# EasyEDA Pro project ProPrj_ESP32-S3.epro, schematic Schematic1_1

## Sheets
1 P1: Board Name: Board1_1; Create Date: 2026-04-16; Page Name: P1; Project Name: ESP32-S3 CNC controller; Schematic Name: Schematic1_1; Update Date: 2026-04-16; Company: EasyEDA.com; Page Size: A4; Version: V1.0
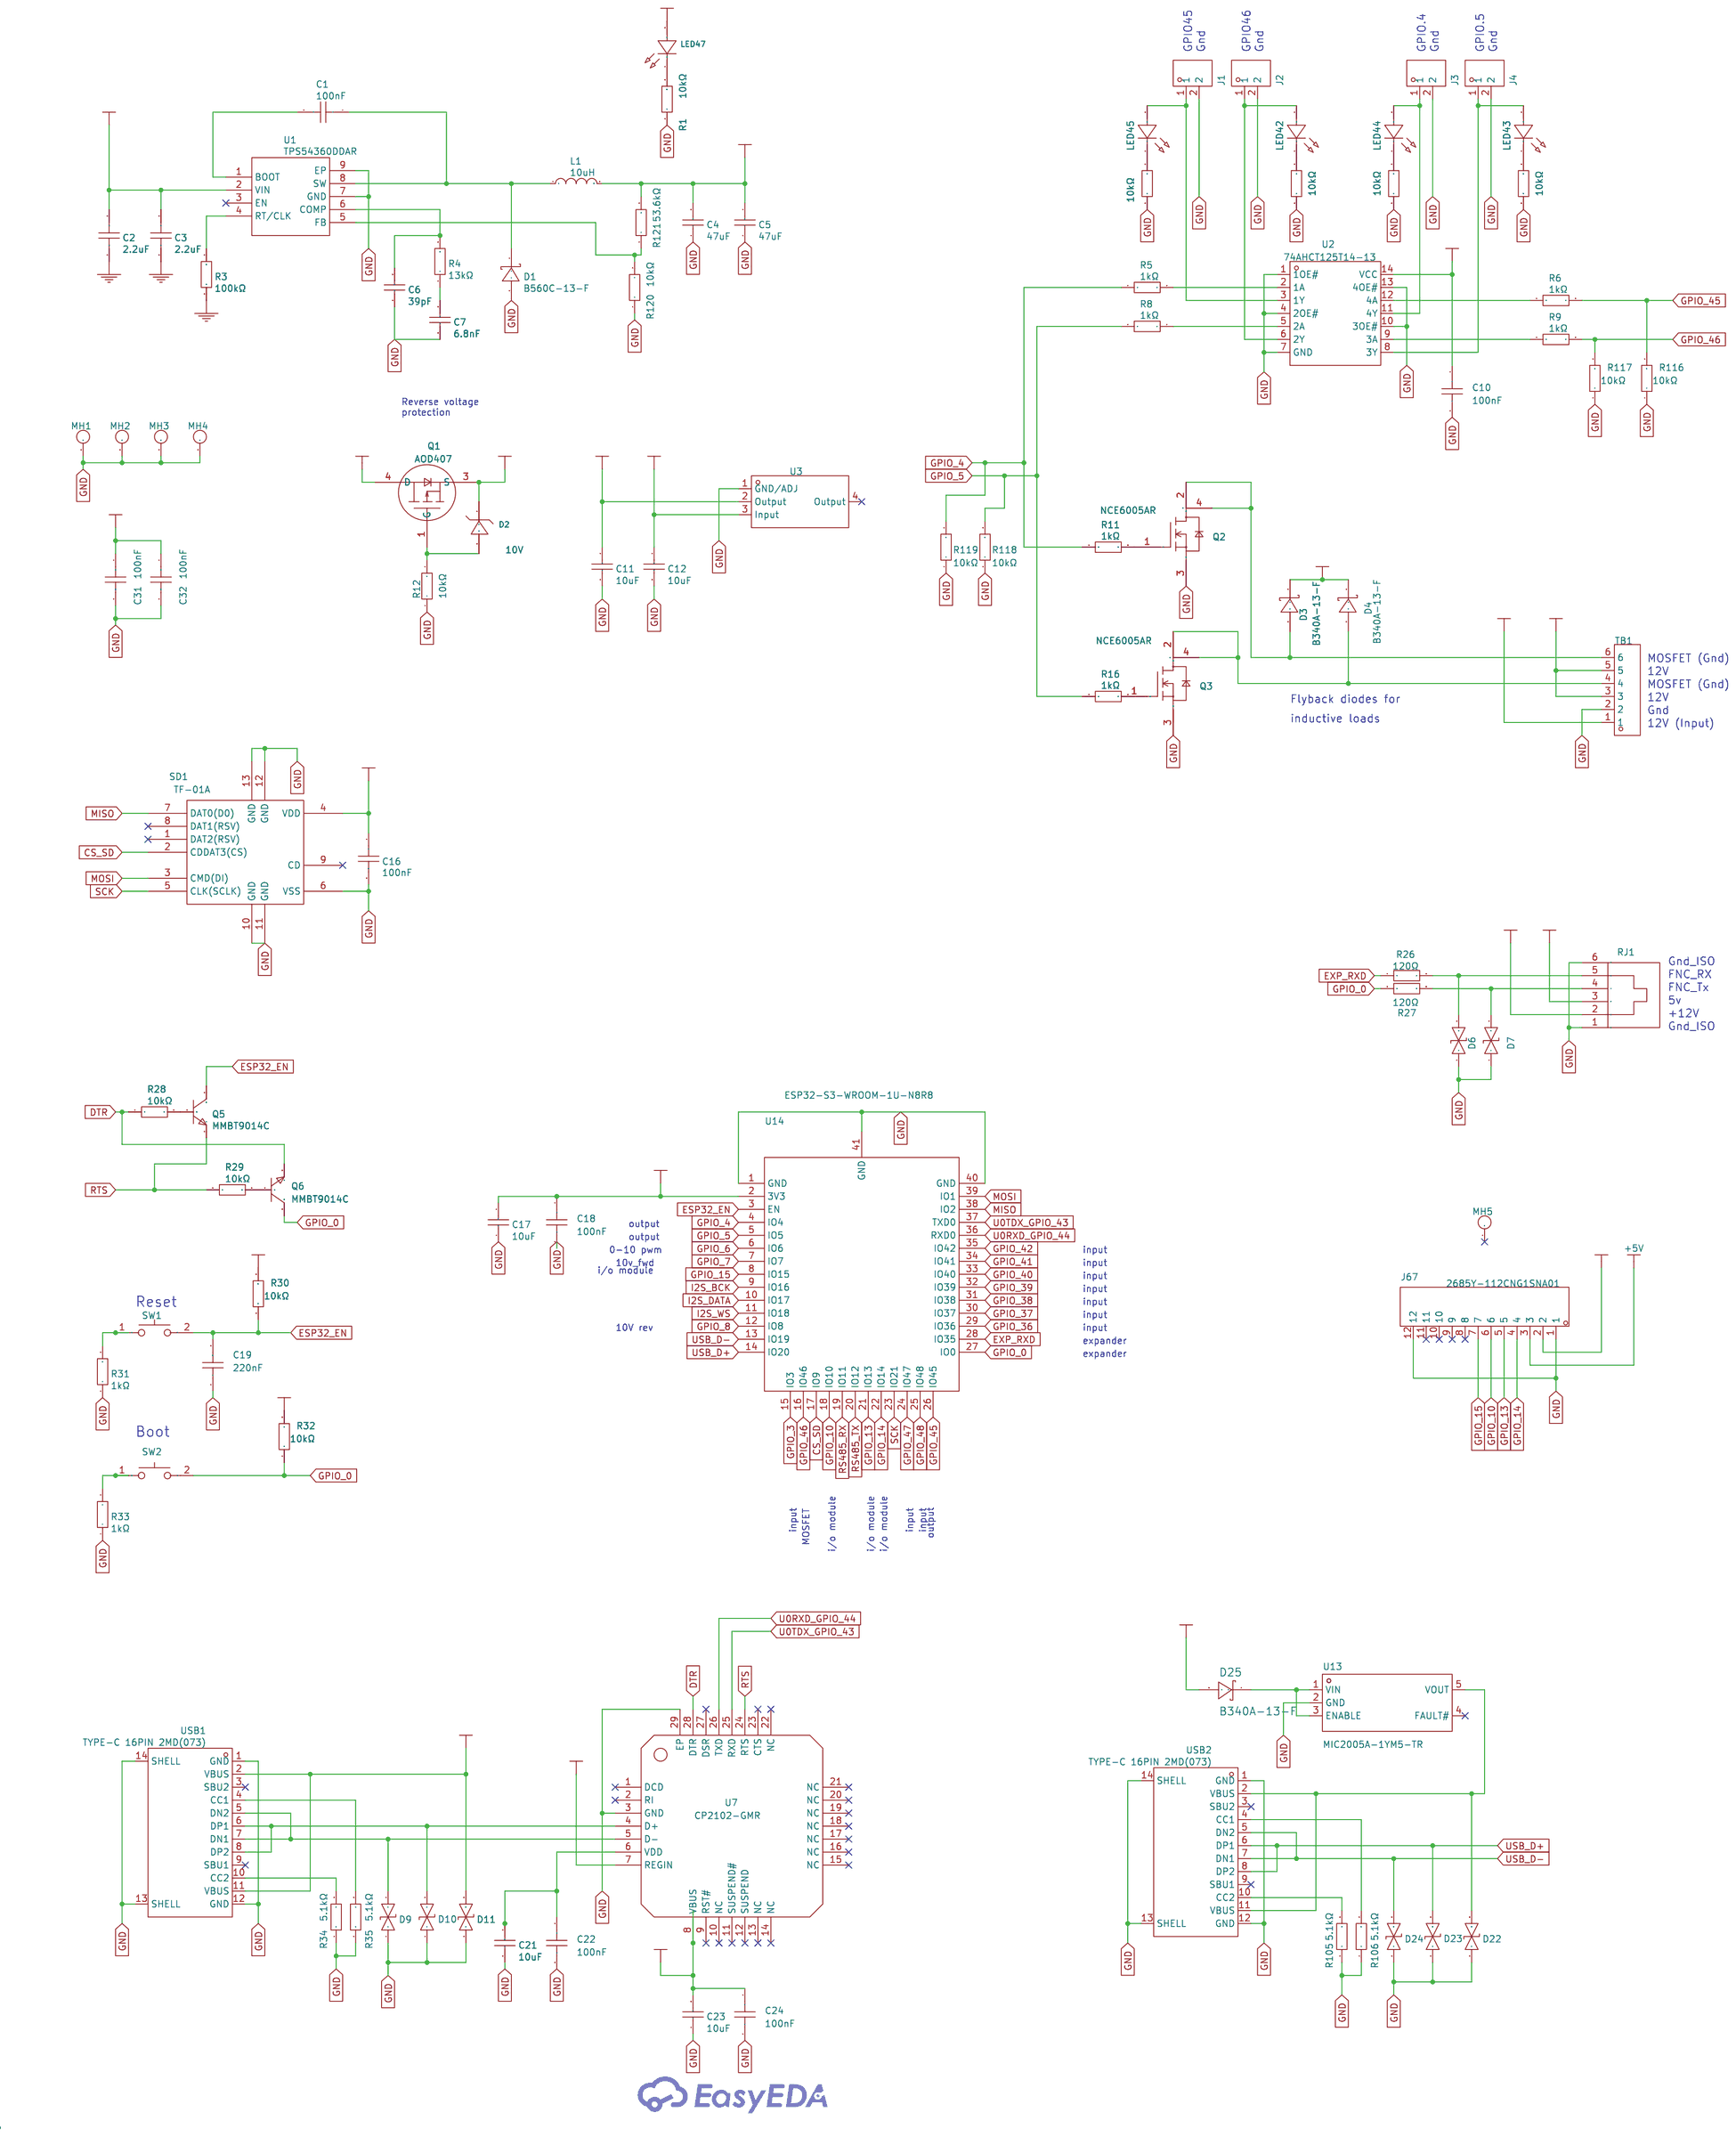
[diagram p0: P1]
2 P2: Page Name: P2
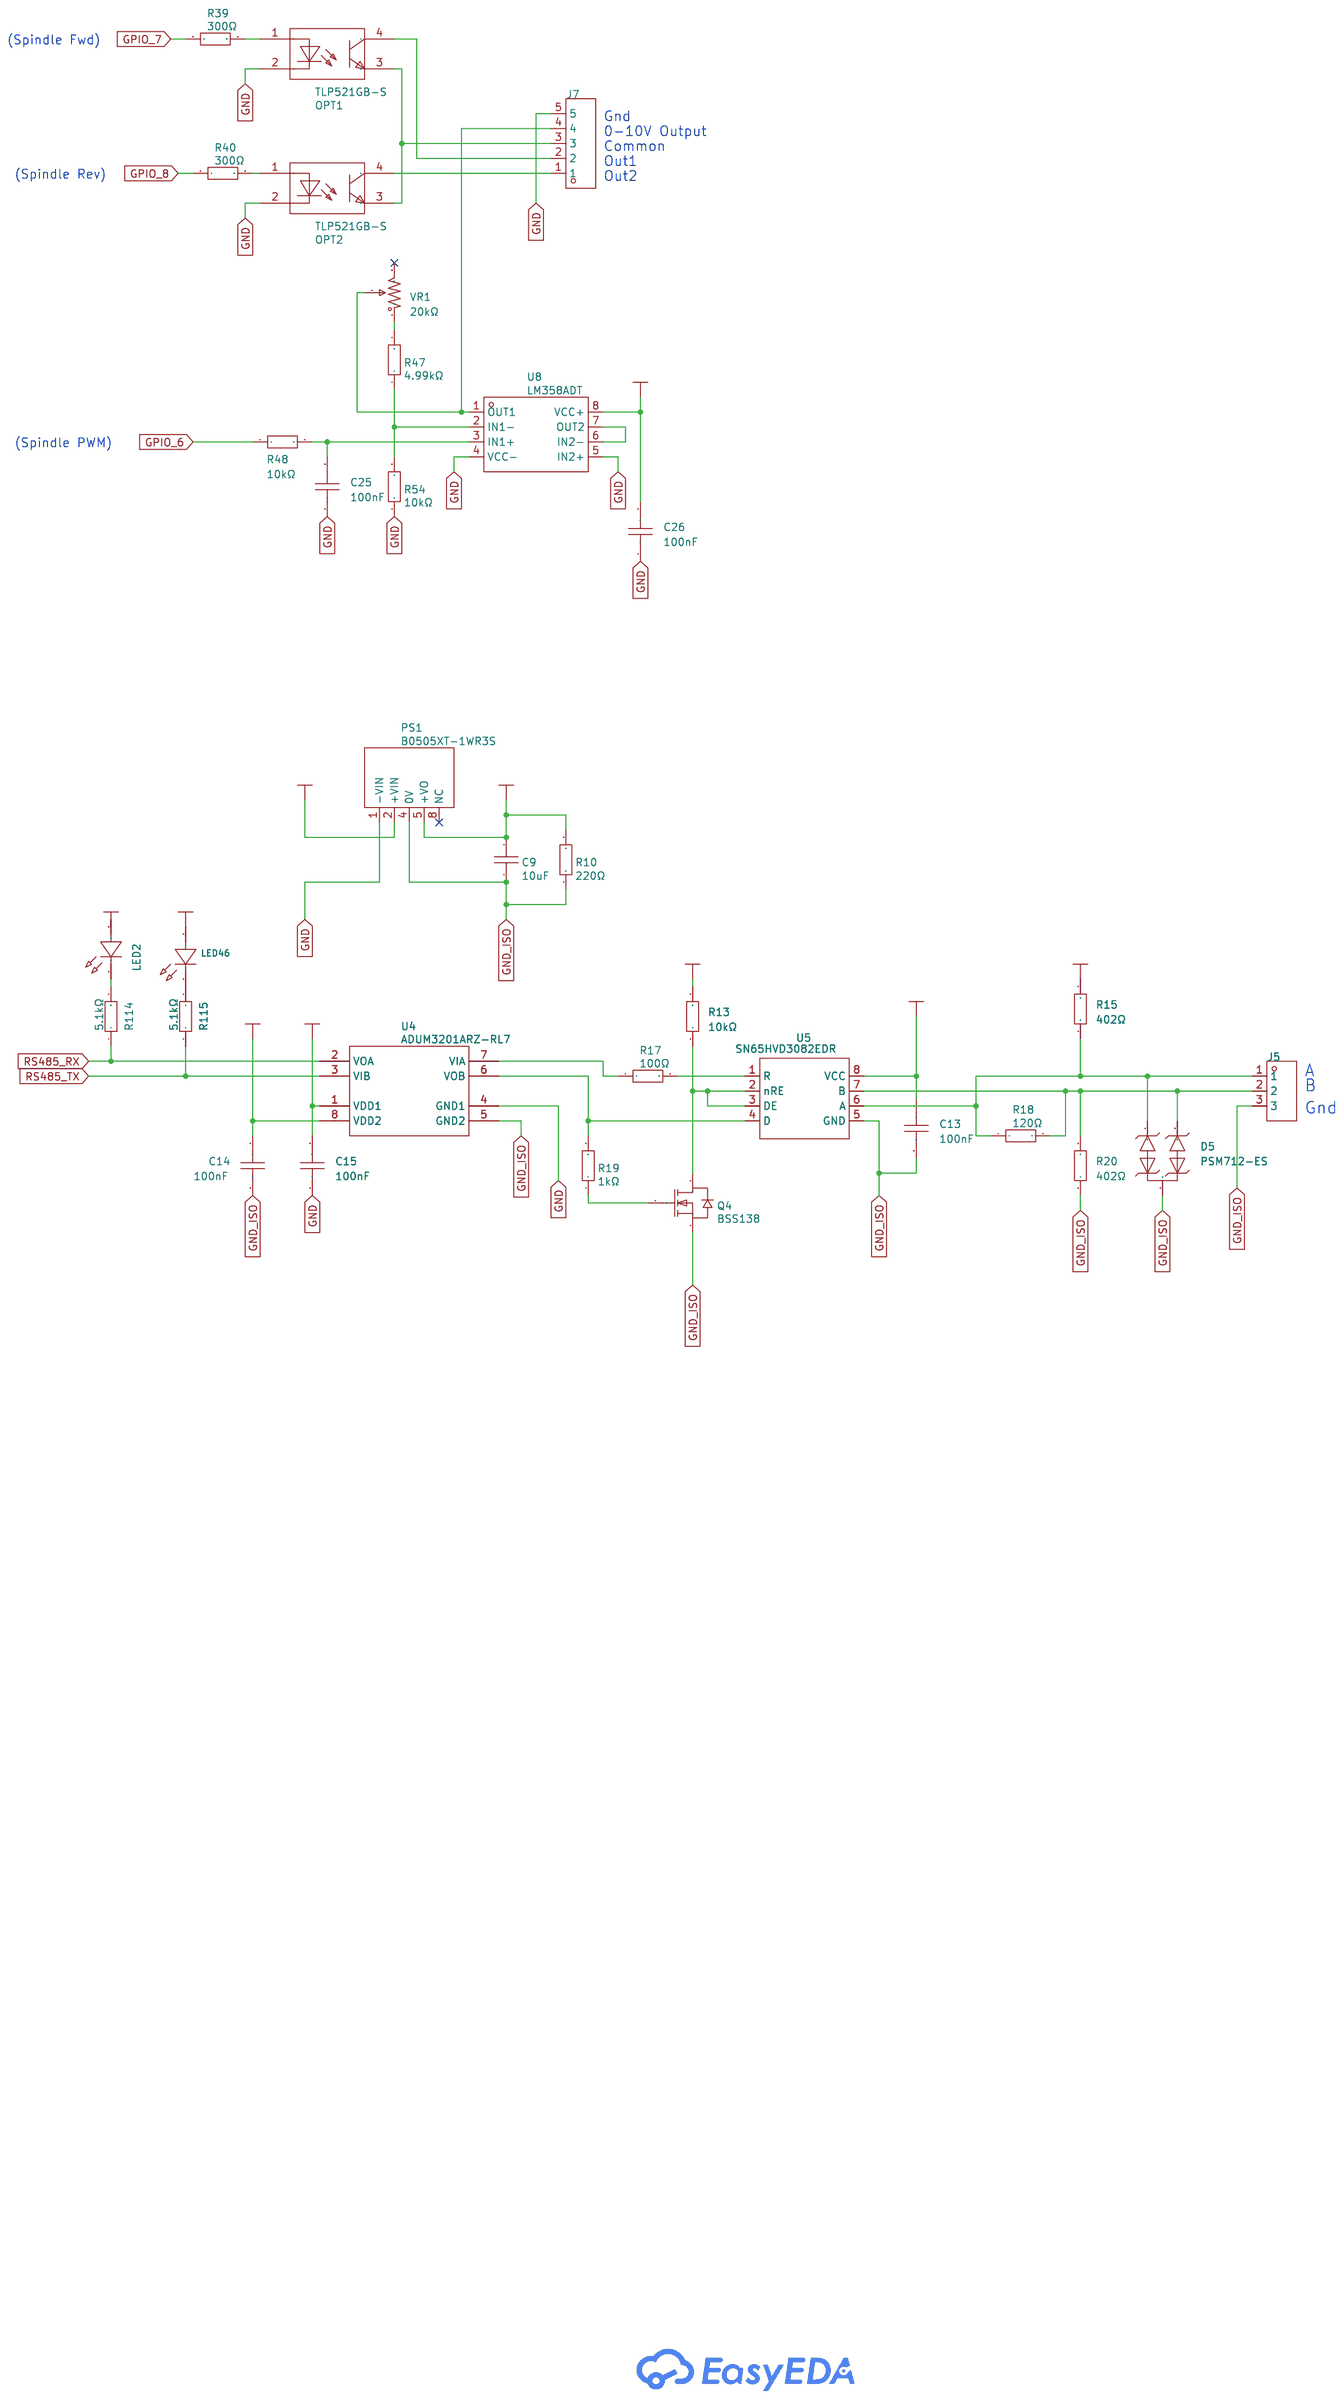
[diagram p1: P2]
3 P3: Page Name: P3; Drawn: B. Dring; Reviewed: B. Dring; Version: V0.9
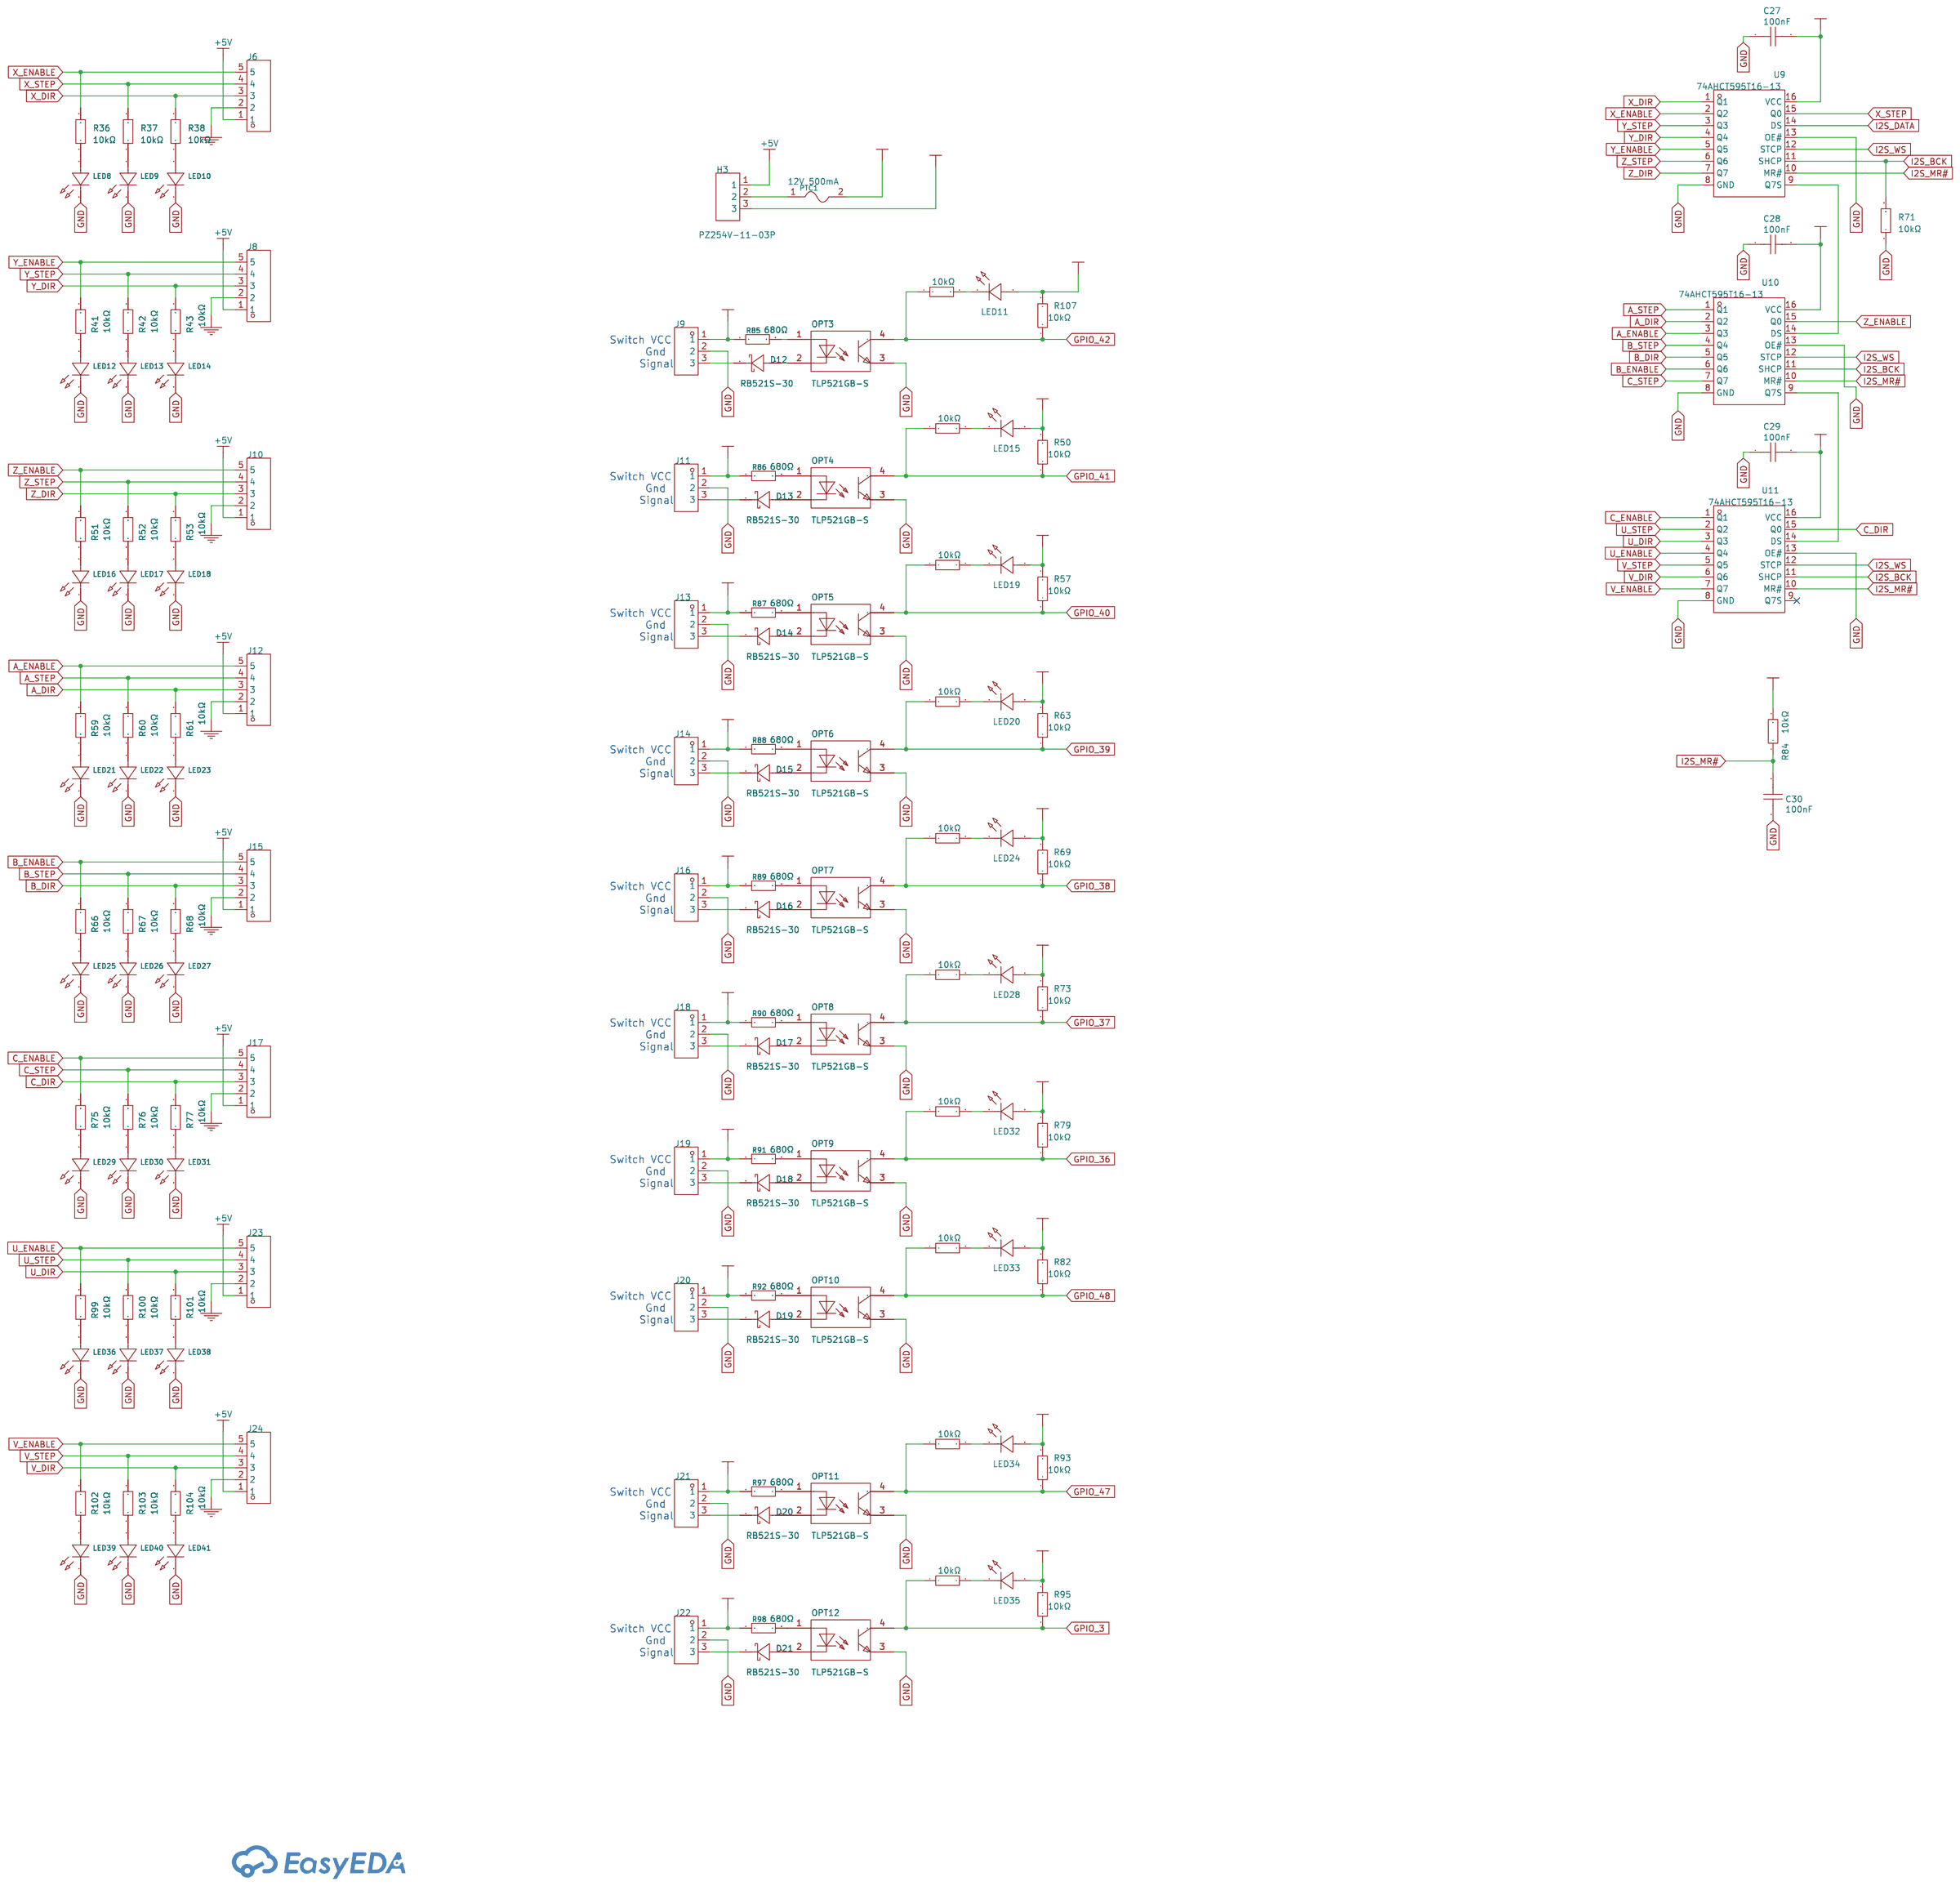
[diagram p2: P3]

## Parts
sheet P1
C1  100nF  [C0402]
C2  2.2uF  [C0805]
C3  2.2uF  [C0805]
C4  47uF  [C0805]
C5  47uF  [C0805]
C6  39pF  [C0402]
C7  6.8nF  [C0402]
C10  100nF  [C0402]
C11  10uF  [C0805]
C12  10uF  [C0805]
C16  100nF  [C0402]
C17  10uF  [C0805]
C18  100nF  [C0402]
C19  220nF  [C0402]
C21  10uF  [C0805]
C22  100nF  [C0402]
C23  10uF  [C0805]
C24  100nF  [C0402]
C31  100nF  [C0402]
C32  100nF  [C0402]
D1  B560C-13-F  [SMC_L7.1-W6.2-LS8.1-RD]
D2  10V  [SOD-123_L2.8-W1.8-LS3.7-RD]
D3  B340A-13-F  [SMA_L4.4-W2.6-LS5.0-RD]
D4  B340A-13-F  [SMA_L4.4-W2.6-LS5.0-RD]
D6  SD03C_C502532  [SOD-323_L1.8-W1.3-LS2.5-BI]
D7  SD03C_C502532  [SOD-323_L1.8-W1.3-LS2.5-BI]
D9  LESD5D5.0CT1G  [SOD-523_L1.2-W0.8-LS1.6-BI]
D10  LESD5D5.0CT1G  [SOD-523_L1.2-W0.8-LS1.6-BI]
D11  LESD5D5.0CT1G  [SOD-523_L1.2-W0.8-LS1.6-BI]
D22  LESD5D5.0CT1G  [SOD-523_L1.2-W0.8-LS1.6-BI]
D23  LESD5D5.0CT1G  [SOD-523_L1.2-W0.8-LS1.6-BI]
D24  LESD5D5.0CT1G  [SOD-523_L1.2-W0.8-LS1.6-BI]
D25  B340A-13-F  [SMA_L4.4-W2.6-LS5.0-RD]
J1  ZX-XH2.54-2PZZ-R  [CONN-TH_XH2.54-2P]
J2  ZX-XH2.54-2PZZ-R  [CONN-TH_XH2.54-2P]
J3  ZX-XH2.54-2PZZ-R  [CONN-TH_XH2.54-2P]
J4  ZX-XH2.54-2PZZ-R  [CONN-TH_XH2.54-2P]
J67  2685Y-112CNG1SNA01  [HDR-TH_12P-P2.54-V-F]
L1  10uH  [IND-SMD_L7.1-W6.6]
LED42  XL-1608SURC-06  [LED0603-RD_RED]
LED43  XL-1608SURC-06  [LED0603-RD_RED]
LED44  XL-1608SURC-06  [LED0603-RD_RED]
LED45  XL-1608SURC-06  [LED0603-RD_RED]
LED47  XL-1608UGC-04  [LED0603-RD_GREEN]
MH1  Mounting Hole 3.5  [MOUNTING HOLE 3.5]
MH2  Mounting Hole 3.5  [MOUNTING HOLE 3.5]
MH3  Mounting Hole 3.5  [MOUNTING HOLE 3.5]
MH4  Mounting Hole 3.5  [MOUNTING HOLE 3.5]
MH5  Mounting Hole 3.5  [MOUNTING HOLE 3.5]
Q1  AOD407  [TO-252-2_L6.5-W6.1-P4.58-LS10.0-TL]
Q2  NCE6005AR  [SOT-223_L6.5-W3.5-P2.30-LS7.0-BR]
Q3  NCE6005AR  [SOT-223_L6.5-W3.5-P2.30-LS7.0-BR]
Q5  MMBT9014C  [SOT-23-3_L2.9-W1.3-P1.90-LS2.4-BR]
Q6  MMBT9014C  [SOT-23-3_L2.9-W1.3-P1.90-LS2.4-BR]
R1  10kΩ  [R0402]
R3  100kΩ  [R0402]
R4  13kΩ  [R0402]
R5  1kΩ  [R0402]
R6  1kΩ  [R0402]
R8  1kΩ  [R0402]
R9  1kΩ  [R0402]
R11  1kΩ  [R0402]
R12  10kΩ  [R0402]
R16  1kΩ  [R0402]
R26  120Ω  [R0402]
R27  120Ω  [R0402]
R28  10kΩ  [R0402]
R29  10kΩ  [R0402]
R30  10kΩ  [R0402]
R31  1kΩ  [R0402]
R32  10kΩ  [R0402]
R33  1kΩ  [R0402]
R34  5.1kΩ  [R0402]
R35  5.1kΩ  [R0402]
R105  5.1kΩ  [R0402]
R106  5.1kΩ  [R0402]
R110  10kΩ  [R0402]
R111  10kΩ  [R0402]
R112  10kΩ  [R0402]
R113  10kΩ  [R0402]
R116  10kΩ  [R0402]
R117  10kΩ  [R0402]
R118  10kΩ  [R0402]
R119  10kΩ  [R0402]
R120  10kΩ  [R0402]
R121  53.6kΩ  [R0402]
RJ1  RJ1  [RJ11-TH_PCB-6P6C-90]
SD1  TF-01A  [TF-SMD_TF-01A]
SW1  SKRKAEE020  [KEY-SMD_L3.9-W3.0-LS5.0]
SW2  SKRKAEE020  [KEY-SMD_L3.9-W3.0-LS5.0]
TB1  DB125-3.5-6P-GN-S  [CONN-TH_6P-P3.50_DB125-3.5-6P-GN-S]
U1  TPS54360DDAR  [SOIC-8_L5.0-W4.0-P1.27-LS6.0-BL-EP2.0]
U2  74AHCT125T14-13  [TSSOP-14_L5.0-W4.4-P0.65-LS6.4-BL]
U3  AMS1117-3.3_C369933  [SOT-223-4_L6.5-W3.5-P2.30-LS7.0-BR]
U7  CP2102-GMR  [WQFN-28_L5.0-W5.0-P0.50-BL-EP3.2]
U13  MIC2005A-1YM5-TR  [SOT-23-5_L3.0-W1.7-P0.95-LS2.8-BL]
U14  ESP32-S3-WROOM-1U-N8R8  [WIRELM-SMD_ESP32-S3-WROOM-1U]
USB1  TYPE-C 16PIN 2MD(073)  [USB-C-SMD_TYPE-C-6PIN-2MD-073]
USB2  TYPE-C 16PIN 2MD(073)  [USB-C-SMD_TYPE-C-6PIN-2MD-073]
sheet P2
C9  10uF  [C0805]
C13  100nF  [C0402]
C14  100nF  [C0402]
C15  100nF  [C0402]
C25  100nF  [C0402]
C26  100nF  [C0402]
D5  PSM712-ES  [SOT-23-3_L2.9-W1.3-P1.90-LS2.4-BR]
J5  ZX-XH2.54-3PZZ  [CONN-TH_3P-P2.54_2501S-3P]
J7  B5B-XH-A-M(LF)(SN)  [CONN-TH_5P-P2.50_JST_B5B-XH-A-M]
LED2  XL-1608SURC-06  [LED0603-RD_RED]
LED46  XL-1608UGC-04  [LED0603-RD_GREEN]
OPT1  TLP521GB-S  [OPTO-SMD-4_L6.5-W4.6-P2.54-LS10.0-TL]
OPT2  TLP521GB-S  [OPTO-SMD-4_L6.5-W4.6-P2.54-LS10.0-TL]
PS1  B0505XT-1WR3S  [PWRM-SMD_B0505XT-1WR3S]
Q4  BSS138  [SOT-23-3_L2.9-W1.3-P1.90-LS2.4-BR]
R10  220Ω  [R0402]
R13  10kΩ  [R0402]
R15  402Ω  [R0402]
R17  100Ω  [R0402]
R18  120Ω  [R0402]
R19  1kΩ  [R0402]
R20  402Ω  [R0402]
R39  300Ω  [R0402]
R40  300Ω  [R0402]
R47  4.99kΩ  [R0402]
R48  10kΩ  [R0402]
R54  10kΩ  [R0402]
R114  5.1kΩ  [R0402]
R115  5.1kΩ  [R0402]
U4  ADUM3201ARZ-RL7  [SOIC-8_L5.0-W4.0-P1.27-LS6.0-BL]
U5  SN65HVD3082EDR  [SOIC-8_L5.0-W4.0-P1.27-LS6.0-BL]
U8  LM358ADT  [SOIC-8_L4.9-W3.9-P1.27-LS6.0-BL]
VR1  20kΩ  [RES-ADJ-SMD_TC33X-2-104E]
sheet P3
C27  100nF  [C0402]
C28  100nF  [C0402]
C29  100nF  [C0402]
C30  100nF  [C0402]
D12  RB521S-30  [SOD-523_L1.2-W0.8-LS1.6-RD]
D13  RB521S-30  [SOD-523_L1.2-W0.8-LS1.6-RD]
D14  RB521S-30  [SOD-523_L1.2-W0.8-LS1.6-RD]
D15  RB521S-30  [SOD-523_L1.2-W0.8-LS1.6-RD]
D16  RB521S-30  [SOD-523_L1.2-W0.8-LS1.6-RD]
D17  RB521S-30  [SOD-523_L1.2-W0.8-LS1.6-RD]
D18  RB521S-30  [SOD-523_L1.2-W0.8-LS1.6-RD]
D19  RB521S-30  [SOD-523_L1.2-W0.8-LS1.6-RD]
D20  RB521S-30  [SOD-523_L1.2-W0.8-LS1.6-RD]
D21  RB521S-30  [SOD-523_L1.2-W0.8-LS1.6-RD]
H3  PZ254V-11-03P  [HDR-TH_3P-P2.54-V-M]
J6  B5B-XH-A-M(LF)(SN)  [CONN-TH_5P-P2.50_JST_B5B-XH-A-M]
J8  B5B-XH-A-M(LF)(SN)  [CONN-TH_5P-P2.50_JST_B5B-XH-A-M]
J9  ZX-XH2.54-3PZZ  [CONN-TH_3P-P2.54_2501S-3P]
J10  B5B-XH-A-M(LF)(SN)  [CONN-TH_5P-P2.50_JST_B5B-XH-A-M]
J11  ZX-XH2.54-3PZZ  [CONN-TH_3P-P2.54_2501S-3P]
J12  B5B-XH-A-M(LF)(SN)  [CONN-TH_5P-P2.50_JST_B5B-XH-A-M]
J13  ZX-XH2.54-3PZZ  [CONN-TH_3P-P2.54_2501S-3P]
J14  ZX-XH2.54-3PZZ  [CONN-TH_3P-P2.54_2501S-3P]
J15  B5B-XH-A-M(LF)(SN)  [CONN-TH_5P-P2.50_JST_B5B-XH-A-M]
J16  ZX-XH2.54-3PZZ  [CONN-TH_3P-P2.54_2501S-3P]
J17  B5B-XH-A-M(LF)(SN)  [CONN-TH_5P-P2.50_JST_B5B-XH-A-M]
J18  ZX-XH2.54-3PZZ  [CONN-TH_3P-P2.54_2501S-3P]
J19  ZX-XH2.54-3PZZ  [CONN-TH_3P-P2.54_2501S-3P]
J20  ZX-XH2.54-3PZZ  [CONN-TH_3P-P2.54_2501S-3P]
J21  ZX-XH2.54-3PZZ  [CONN-TH_3P-P2.54_2501S-3P]
J22  ZX-XH2.54-3PZZ  [CONN-TH_3P-P2.54_2501S-3P]
J23  B5B-XH-A-M(LF)(SN)  [CONN-TH_5P-P2.50_JST_B5B-XH-A-M]
J24  B5B-XH-A-M(LF)(SN)  [CONN-TH_5P-P2.50_JST_B5B-XH-A-M]
LED8  XL-1608UGC-04  [LED0603-RD_GREEN]
LED9  XL-1608UGC-04  [LED0603-RD_GREEN]
LED10  XL-1608UGC-04  [LED0603-RD_GREEN]
LED11  XL-1608SURC-06  [LED0603-RD_RED]
LED12  XL-1608UGC-04  [LED0603-RD_GREEN]
LED13  XL-1608UGC-04  [LED0603-RD_GREEN]
LED14  XL-1608UGC-04  [LED0603-RD_GREEN]
LED15  XL-1608SURC-06  [LED0603-RD_RED]
LED16  XL-1608UGC-04  [LED0603-RD_GREEN]
LED17  XL-1608UGC-04  [LED0603-RD_GREEN]
LED18  XL-1608UGC-04  [LED0603-RD_GREEN]
LED19  XL-1608SURC-06  [LED0603-RD_RED]
LED20  XL-1608SURC-06  [LED0603-RD_RED]
LED21  XL-1608UGC-04  [LED0603-RD_GREEN]
LED22  XL-1608UGC-04  [LED0603-RD_GREEN]
LED23  XL-1608UGC-04  [LED0603-RD_GREEN]
LED24  XL-1608SURC-06  [LED0603-RD_RED]
LED25  XL-1608UGC-04  [LED0603-RD_GREEN]
LED26  XL-1608UGC-04  [LED0603-RD_GREEN]
LED27  XL-1608UGC-04  [LED0603-RD_GREEN]
LED28  XL-1608SURC-06  [LED0603-RD_RED]
LED29  XL-1608UGC-04  [LED0603-RD_GREEN]
LED30  XL-1608UGC-04  [LED0603-RD_GREEN]
LED31  XL-1608UGC-04  [LED0603-RD_GREEN]
LED32  XL-1608SURC-06  [LED0603-RD_RED]
LED33  XL-1608SURC-06  [LED0603-RD_RED]
LED34  XL-1608SURC-06  [LED0603-RD_RED]
LED35  XL-1608SURC-06  [LED0603-RD_RED]
LED36  XL-1608UGC-04  [LED0603-RD_GREEN]
LED37  XL-1608UGC-04  [LED0603-RD_GREEN]
LED38  XL-1608UGC-04  [LED0603-RD_GREEN]
LED39  XL-1608UGC-04  [LED0603-RD_GREEN]
LED40  XL-1608UGC-04  [LED0603-RD_GREEN]
LED41  XL-1608UGC-04  [LED0603-RD_GREEN]
OPT3  TLP521GB-S  [OPTO-SMD-4_L6.5-W4.6-P2.54-LS10.0-TL]
OPT4  TLP521GB-S  [OPTO-SMD-4_L6.5-W4.6-P2.54-LS10.0-TL]
OPT5  TLP521GB-S  [OPTO-SMD-4_L6.5-W4.6-P2.54-LS10.0-TL]
OPT6  TLP521GB-S  [OPTO-SMD-4_L6.5-W4.6-P2.54-LS10.0-TL]
OPT7  TLP521GB-S  [OPTO-SMD-4_L6.5-W4.6-P2.54-LS10.0-TL]
OPT8  TLP521GB-S  [OPTO-SMD-4_L6.5-W4.6-P2.54-LS10.0-TL]
OPT9  TLP521GB-S  [OPTO-SMD-4_L6.5-W4.6-P2.54-LS10.0-TL]
OPT10  TLP521GB-S  [OPTO-SMD-4_L6.5-W4.6-P2.54-LS10.0-TL]
OPT11  TLP521GB-S  [OPTO-SMD-4_L6.5-W4.6-P2.54-LS10.0-TL]
OPT12  TLP521GB-S  [OPTO-SMD-4_L6.5-W4.6-P2.54-LS10.0-TL]
PTC1  12V 500mA  [F0805]
R36  10kΩ  [R0402]
R37  10kΩ  [R0402]
R38  10kΩ  [R0402]
R41  10kΩ  [R0402]
R42  10kΩ  [R0402]
R43  10kΩ  [R0402]
R44  10kΩ  [R0402]
R49  10kΩ  [R0402]
R50  10kΩ  [R0402]
R51  10kΩ  [R0402]
R52  10kΩ  [R0402]
R53  10kΩ  [R0402]
R56  10kΩ  [R0402]
R57  10kΩ  [R0402]
R59  10kΩ  [R0402]
R60  10kΩ  [R0402]
R61  10kΩ  [R0402]
R62  10kΩ  [R0402]
R63  10kΩ  [R0402]
R65  10kΩ  [R0402]
R66  10kΩ  [R0402]
R67  10kΩ  [R0402]
R68  10kΩ  [R0402]
R69  10kΩ  [R0402]
R71  10kΩ  [R0402]
R72  10kΩ  [R0402]
R73  10kΩ  [R0402]
R75  10kΩ  [R0402]
R76  10kΩ  [R0402]
R77  10kΩ  [R0402]
R78  10kΩ  [R0402]
R79  10kΩ  [R0402]
R81  10kΩ  [R0402]
R82  10kΩ  [R0402]
R84  10kΩ  [R0402]
R85  680Ω  [R0402]
R86  680Ω  [R0402]
R87  680Ω  [R0402]
R88  680Ω  [R0402]
R89  680Ω  [R0402]
R90  680Ω  [R0402]
R91  680Ω  [R0402]
R92  680Ω  [R0402]
R93  10kΩ  [R0402]
R94  10kΩ  [R0402]
R95  10kΩ  [R0402]
R96  10kΩ  [R0402]
R97  680Ω  [R0402]
R98  680Ω  [R0402]
R99  10kΩ  [R0402]
R100  10kΩ  [R0402]
R101  10kΩ  [R0402]
R102  10kΩ  [R0402]
R103  10kΩ  [R0402]
R104  10kΩ  [R0402]
R107  10kΩ  [R0402]
U9  74AHCT595T16-13  [TSSOP-16_L5.0-W4.4-P0.65-LS6.4-BL]
U10  74AHCT595T16-13  [TSSOP-16_L5.0-W4.4-P0.65-LS6.4-BL]
U11  74AHCT595T16-13  [TSSOP-16_L5.0-W4.4-P0.65-LS6.4-BL]

## Library data of the parts
C1 C10 C13-C16 C18 C22 C24-C32 = 100nF: Supplier: LCSC; Manufacturer: MuRata; Manufacturer Part: GCM155R71C104KA55D; Supplier Part: C85857; JLCPCB Part Class: Extended Part
C2 C3 = 2.2uF: Supplier: LCSC; Supplier Part: C513763; Manufacturer: SAMWHA(三和); Manufacturer Part: CS2012X5R225K500NRE; JLCPCB Part Class: Extended Part; link: https://lcsc.com/eda_search?q=C513763&amp;%26type=1&amp;ref=editor
C4 C5 = 47uF: Supplier: LCSC; Manufacturer Part: CL21A476MQYNNNE; Manufacturer: SAMSUNG; Supplier Part: C16780; JLCPCB Part Class: Basic Part
C6 = 39pF: Supplier: LCSC; Manufacturer: YAGEO; Manufacturer Part: CC0402JRNPO9BN390; Supplier Part: C106223; JLCPCB Part Class: Extended Part
C7 = 6.8nF: Supplier: LCSC; Manufacturer: FH; Manufacturer Part: 0402B682K500NT; Supplier Part: C1542; JLCPCB Part Class: Basic Part
C11 C12 C17 C21 C23 = 10uF: Supplier: LCSC; Manufacturer Part: CL21A106KAYNNNE; Manufacturer: SAMSUNG; Supplier Part: C15850; JLCPCB Part Class: Basic Part
C19 = 0402B224K160NT: Capacitance:220nF Tolerance:±10% Tolerance:±10% Voltage Rating:16V Temperature Coefficient:X7R; LCSC Part Name: 220nF ±10% 16V; Supplier Part: C192432; Manufacturer: FH(风华); Supplier Footprint: 0402; JLCPCB Part Class: Extended Part; Datasheet: https://item.szlcsc.com/datasheet/0402B224K160NT/222636.html; Supplier: LCSC; Tolerance: ±10%; Voltage Rating: 16V; Temperature Coefficient: X7R
D1 = B560C-13-F: Supplier: LCSC; Manufacturer: DIODES(美台); Supplier Part: C85100; JLCPCB Part Class: Extended Part
D2 = BZT52C10_C173431: Diode Configuration:Single Zener Voltage (Nom):10V Reverse Leakage Current (Ir):200nA@7V Zener Voltage (Range):9.4V~10.6V Zener Voltage (Range):9.4V~10.6V Power Dissipation:500mW Zener Impedance (Zzt):20Ω Tolerance:- Tolerance:-; LCSC Part Name: BZT52C10; Supplier Part: C173431; Manufacturer: MDD; Manufacturer Part: BZT52C10; Supplier Footprint: SOD-123; JLCPCB Part Class: Extended Part; Datasheet: https://atta.szlcsc.com/upload/public/pdf/source/20230823/A46C7C97908205398E4407DE202CED03.pdf; Supplier: LCSC; Diode Configuration: Single; Reverse Leakage Current (Ir): 200nA@7V; Zener Voltage (Range): 9.4V~10.6V; Power Dissipation: 500mW; Zener Impedance (Zzt): 20Ω
D3 D4 D25 = B340A-13-F: Supplier: LCSC; Manufacturer: DIODES(美台); Supplier Part: C85098; JLCPCB Part Class: Extended Part; link: https://lcsc.com/eda_search?q=C85098&amp;%26type=1&amp;ref=editor
D6 D7 = SD03C_C502532: Supplier: LCSC; Supplier Part: C502532; Manufacturer: MDD; Manufacturer Part: SD03C; JLCPCB Part Class: Extended Part; Contributor: LCSC; spicePre: D
D9-D11 D22-D24 = LESD5D5.0CT1G: Supplier: LCSC; Supplier Part: C383211; Manufacturer: Leshan Radio; JLCPCB Part Class: Extended Part
J1-J4 = ZX-XH2.54-2PZZ-R: Pins Structure:1x2P Pitch:2.5mm Mounting Type:Direct Insert Reference Series:XH Number of Pins:2P Number of Rows:1 Number of PINs Per Row:2 Row Spacing:- Rated Current:3A Contact Material:Copper alloy Contact Plating:Tin Operating Temperature:-25℃~+85℃ Op; LCSC Part Name: 1x2P 间距:2.5mm 直插 系列:XH; Supplier Part: C22388624; Manufacturer: Megastar(兆星); Supplier Footprint: 插件,P=2.5mm; JLCPCB Part Class: Extended Part; Datasheet: https://atta.szlcsc.com/upload/public/pdf/source/20240429/AA686AF86527F4AA0E405D3AA558B9D4.pdf; Supplier: LCSC; Pins Structure: 1x2P; Pitch: 2.5mm; Mounting Type: Direct Insert; Reference Series: XH; Number of Pins: 2P; Number of Rows: 1; Number of PINs Per Row: 2; Rated Current: 3A; Contact Material: Copper alloy; Contact Plating: Tin; Operating Temperature: -25℃~+85℃; Rated Voltage (Max): 250V; Plastic Material: PA66; Flame Retardant Rating: UL94V-0; Color: Red; Z-Height of the Board: 7mm; X-Length of Bottom Edge on Board (Spacing Line): 7.5mm; Y-Width of Bottom Edge on Board: 5.75mm
J67 = 2685Y-112CNG1SNA01_C350303: Holes Structure:1x12P Pitch:2.54mm Row Spacing:2.54mm Circular Hole / Square Hole:Square Hole Mounting Type:Through Hole Number of Rows:1 Number of Positions:12P Current Rating:3A Voltage Rating (Max):- Holes Direction:Top Insulation Height:8.5mm Contact; LCSC Part Name: 1x12P 间距:2.54mm 直插; Supplier Part: C350303; Manufacturer: 华宇创; Supplier Footprint: 插件,P=2.54mm; JLCPCB Part Class: Extended Part; Datasheet: https://item.szlcsc.com/datasheet/2685Y-112CNG1SNA01/326592.html; Supplier: LCSC; Holes Structure: 1x12P; Pitch: 2.54mm; Row Spacing: 2.54mm; Circular Hole / Square Hole: Square Hole; Mounting Type: Through Hole; Number of Rows: 1; Number of Positions: 12P; Current Rating: 3A; Holes Direction: Top; Insulation Height: 8.5mm; Contact Material: Brass; Contact Plating: Gold; Operating Temperature: -40℃~+105℃; PIN Length: 3.2mm
L1 = 10uH: Supplier: LCSC; Supplier Part: C436542; Manufacturer: PROD(谱罗德); Manufacturer Part: PSPMAA0603-100M-ANF; JLCPCB Part Class: Extended Part; link: https://lcsc.com/eda_search?q=C436542&amp;%26type=1&amp;ref=editor
LED2 LED11 LED15 LED19 LED20 LED24 LED28 LED32-LED35 LED42-LED45 = XL-1608SURC-06: Supplier: LCSC; Supplier Part: C965799; Manufacturer: XINGLIGHT(成兴光); JLCPCB Part Class: Extended Part; Contributor: LCSC; spicePre: L
LED8-LED10 LED12-LED14 LED16-LED18 LED21-LED23 LED25-LED27 LED29-LED31 LED36-LED41 LED46 LED47 = XL-1608UGC-04: Lamp Holder Type:- Emitted Color:Emerald Forward Voltage (VF):- Forward Voltage (VF):- Power Dissipation:80mW Forward Current:25mA Dominant Wavelength:516nm~525nm Dominant Wavelength:516nm~525nm Peak Wavelength:534nm Diode Configuration:独立二极管 Lens Color:无; Supplier Part: C965804; Manufacturer: XINGLIGHT(成兴光); Supplier Footprint: 0603; JLCPCB Part Class: Extended Part; Datasheet: https://atta.szlcsc.com/upload/public/pdf/source/20221102/520D6E465E5CFD1609C8A4DBC80D4018.pdf; Supplier: LCSC; Emitted Color: Emerald; Power Dissipation: 80mW; Forward Current: 25mA; Dominant Wavelength: 516nm~525nm; Peak Wavelength: 534nm; Diode Configuration: 独立二极管; Lens Color: 无色透明透镜; Viewing Angle: 120°; Mounting Sytle: Positive post; Operating Temperature: -30℃~+85℃
MH1-MH5 = Mounting Hole 3.5
Q1 = AOD407: Type:1 Piece P-Channel Drain Source Voltage (Vdss): Continuous Drain Current (Id): Drain Source On Resistance (RDS(on)@Vgs,Id):115mΩ@10V,12A Power Dissipation (Pd): Gate Threshold Voltage (Vgs(th)@Id):1.5V@250uA Total Gate Charge (Qg@Vgs):20nC@10V Input C; LCSC Part Name: 1个P沟道 耐压:60V 电流:12A; Supplier Part: C75092; Manufacturer: AOS; Supplier Footprint: TO-252-2(DPAK); JLCPCB Part Class: Extended Part; Datasheet: https://atta.szlcsc.com/upload/public/pdf/source/20170925/C75092_1506321736332990541.pdf; Supplier: LCSC; Type: 1 Piece P-Channel; Drain Source On Resistance (RDS(on)@Vgs,Id): 115mΩ@10V,12A; Gate Threshold Voltage (Vgs(th)@Id): 1.5V@250uA; Total Gate Charge (Qg@Vgs): 20nC@10V; Input Capacitance (Ciss@Vds): 1.185nF@30V; Reverse Transfer Capacitance (Crss@Vds): 46pF@30V; Operating Temperature: -55℃~+175℃
Q2 Q3 = NCE6005AR: Supplier: LCSC; Supplier Part: C189606; Manufacturer: Wuxi NCE Power Semiconductor; JLCPCB Part Class: Extended Part
Q5 Q6 = MMBT9014C: Supplier: LCSC; Manufacturer: SEMTECH; Supplier Part: C90157; JLCPCB Part Class: Extended Part
R1 R12 R13 R28-R30 R32 R36-R38 R41-R44 R48-R54 R56 R57 R59-R63 R65-R69 R71-R73 R75-R79 R81 R82 R84 R93-R96 R99-R104 R107 R110-R113 R116-R120 = 0402WGF1002TCE: Type:Thick Film Resistors Resistance:10kΩ Tolerance:±1% Tolerance:±1% Power(Watts): Overload Voltage (Max): Temperature Coefficient:±100ppm/℃ Temperature Coefficient:±100ppm/℃ Operating Temperature Range:-55℃~+155℃ Operating Temperature Range:-55℃~+155℃; LCSC Part Name: 10kΩ ±1% 62.5mW 厚膜电阻; Supplier Part: C25744; Manufacturer: UNI-ROYAL(厚声); Supplier Footprint: 0402; JLCPCB Part Class: Basic Part; Datasheet: https://atta.szlcsc.com/upload/public/pdf/source/20200306/C422600_1E6D84923E4A46A82E41ADD87F860B5C.pdf; Supplier: LCSC; Type: Thick Film Resistors; Tolerance: ±1%; Temperature Coefficient: ±100ppm/℃; Operating Temperature Range: -55℃~+155℃
R3 = 100kΩ: Supplier: LCSC; Manufacturer: UniOhm; Manufacturer Part: 0402WGF1003TCE; Supplier Part: C25741; Resistance: 100K; JLCPCB Part Class: Basic Part
R4 = 13kΩ: Supplier: LCSC; Manufacturer: UniOhm; Manufacturer Part: 0402WGF1302TCE; Supplier Part: C25754; Resistance: 13K; JLCPCB Part Class: Extended Part
R5 R6 R8 R9 R11 R16 R19 R31 R33 = 0402WGF1001TCE: Type:Thick Film Resistors Resistance:1kΩ Tolerance:±1% Tolerance:±1% Power(Watts): Overload Voltage (Max): Temperature Coefficient:±100ppm/℃ Temperature Coefficient:±100ppm/℃ Operating Temperature Range:-55℃~+155℃ Operating Temperature Range:-55℃~+155℃; LCSC Part Name: 1kΩ ±1% 62.5mW 厚膜电阻; Supplier Part: C11702; Manufacturer: UNI-ROYAL(厚声); Supplier Footprint: 0402; JLCPCB Part Class: Basic Part; Datasheet: https://atta.szlcsc.com/upload/public/pdf/source/20200306/C422600_1E6D84923E4A46A82E41ADD87F860B5C.pdf; Supplier: LCSC; Type: Thick Film Resistors; Tolerance: ±1%; Temperature Coefficient: ±100ppm/℃; Operating Temperature Range: -55℃~+155℃
R18 R26 R27 = CR0402FF1200G: Type:Thick Film Resistors Resistance: Tolerance:±1% Tolerance:±1% Power(Watts): Overload Voltage (Max): Temperature Coefficient:±200ppm/℃ Temperature Coefficient:±200ppm/℃ Operating Temperature Range:-55℃~+125℃ Operating Temperature Range:-55℃~+125℃; LCSC Part Name: 厚膜电阻 120Ω ±1% 62.5mW; Supplier Part: C100218; Manufacturer: LIZ(丽智电子); Supplier Footprint: 0402; JLCPCB Part Class: Extended Part; Datasheet: https://atta.szlcsc.com/upload/public/pdf/source/20180403/C189438_6D658388CC7843F35BBC9018D03F0B8E.pdf; Supplier: LCSC; Type: Thick Film Resistors; Tolerance: ±1%; Temperature Coefficient: ±200ppm/℃; Operating Temperature Range: -55℃~+125℃
R34 R35 R105 R106 R114 R115 = 5.1kΩ: Supplier: LCSC; Manufacturer: UniOhm; Manufacturer Part: 0402WGF5101TCE; Supplier Part: C25905; Resistance: 5.1K; JLCPCB Part Class: Basic Part
R121 = 0402WGF5362TCE: Type:Thick Film Resistors Resistance:53.6kΩ Tolerance:±1% Tolerance:±1% Power(Watts): Overload Voltage (Max): Temperature Coefficient:±100ppm/℃ Temperature Coefficient:±100ppm/℃ Operating Temperature Range:-55℃~+155℃ Operating Temperature Range:-55℃~+155℃; LCSC Part Name: 53.6kΩ ±1% 62.5mW 厚膜电阻; Supplier Part: C53398; Manufacturer: UNI-ROYAL(厚声); Supplier Footprint: 0402; JLCPCB Part Class: Extended Part; Datasheet: https://atta.szlcsc.com/upload/public/pdf/source/20200306/C422600_1E6D84923E4A46A82E41ADD87F860B5C.pdf; Supplier: LCSC; Type: Thick Film Resistors; Tolerance: ±1%; Temperature Coefficient: ±100ppm/℃; Operating Temperature Range: -55℃~+155℃
RJ1 = RJ1: Supplier: LCSC; Supplier Part: C189750; Manufacturer: Ckmtw(灿科盟); Manufacturer Part: R-RJ11R06P-A800; JLCPCB Part Class: Extended Part; Contributor: LCSC; spicePre: R; spiceSymbolName: PCB-6P6C-90
SD1 = TF-01A: Supplier: LCSC; Manufacturer: 韩国韩荣; Supplier Part: C91145; JLCPCB Part Class: Extended Part; link: https://lcsc.com/eda_search?q=C91145&amp;%26type=1&amp;ref=editor
SW1 SW2 = SKRKAEE020: Supplier: LCSC; Manufacturer: ALPS; Supplier Part: C115357; JLCPCB Part Class: Extended Part
TB1 = DB125-3.5-6P-GN-S_C5290323: Number of Positions or Pins:1x6P Pitch:3.5mm Color:Green Mounting Type:Direct Insert Number of Pins:6P Number of Rows:1 Number of PINs Per Row:6 Screw Specification:M2 Current Rating:10A Voltage Rating (Max):300V Wire Gauge - AWG:16~28 Wire Gauge - AWG:16; LCSC Part Name: 1x6P 3.5mm 直插 排数:1 每排P数:6; Supplier Part: C5290323; Manufacturer: DORABO(地博电气); Supplier Footprint: 插件,P=3.5mm; JLCPCB Part Class: Extended Part; Datasheet: https://atta.szlcsc.com/upload/public/pdf/source/20221227/3B943AA1CFCAE24F1BA4E72404938A89.pdf; Supplier: LCSC; Number of Positions or Pins: 1x6P; Pitch: 3.5mm; Color: Green; Mounting Type: Direct Insert; Number of Pins: 6P; Number of Rows: 1; Number of PINs Per Row: 6; Screw Specification: M2; Current Rating: 10A; Voltage Rating (Max): 300V; Wire Gauge - AWG: 16~28; Wire Gauge - mm2: 1; Operating Temperature: -40℃~+105℃
U1 = TPS54360DDAR: Supplier: LCSC; Manufacturer: TI(德州仪器); Supplier Part: C44377; JLCPCB Part Class: Extended Part; link: https://lcsc.com/eda_search?q=C44377&amp;%26type=1&amp;ref=editor
U2 = 74AHCT125T14-13: Supplier: LCSC; Supplier Part: C176917; Manufacturer: DIODES(美台); JLCPCB Part Class: Extended Part; link: https://lcsc.com/eda_search?q=C176917&amp;%26type=1&amp;ref=editor
U3 = AMS1117-3.3_C369933: Supplier: LCSC; Supplier Part: C369933; Manufacturer: KEXIN; Manufacturer Part: AMS1117-3.3; JLCPCB Part Class: Extended Part
U7 = CP2102-GMR: Supplier: LCSC; Manufacturer: SILICON LABS; Supplier Part: C6568; JLCPCB Part Class: Basic Part
U13 = MIC2005A-1YM5-TR: Type:High Side Switch Number of Channels:1 Control Input Logic:Active High Maximum Continuous Current:500mA Voltage - Supply:2.5V~5.5V Voltage - Supply:2.5V~5.5V RDS(on):170mΩ Operating Temperature-:-40℃~+85℃ Operating Temperature-:-40℃~+85℃ Features:Ov; LCSC Part Name: 固定和可调电流限制功率分配开关; Supplier Part: C81399; Manufacturer: MICROCHIP(美国微芯); Supplier Footprint: SOT-23-5; JLCPCB Part Class: Extended Part; Datasheet: https://item.szlcsc.com/datasheet/MIC2005A-1YM5-TR/82550.html; Supplier: LCSC; Type: High Side Switch; Number of Channels: 1; Control Input Logic: Active High; Maximum Continuous Current: 500mA; Voltage - Supply: 2.5V~5.5V; RDS(on): 170mΩ; Operating Temperature	-: -40℃~+85℃; Features: Over Temperature Protection；Undervoltage Protection(UVP)
U14 = ESP32-S3-WROOM-1U-N8R8: LCSC Part Name: 通用型Wi-Fi+低功耗蓝牙MCU模组; Supplier Part: C2980300; Manufacturer: ESPRESSIF(乐鑫); Supplier Footprint: SMD,19.2x18mm; JLCPCB Part Class: Extended Part; Datasheet: https://item.szlcsc.com/datasheet/ESP32-S3-WROOM-1U-N8R8/3401552.html; Supplier: LCSC
USB1 USB2 = TYPE-C 16PIN 2MD(073): Supplier: LCSC; Supplier Part: C2765186; Manufacturer: SHOU HAN(首韩); JLCPCB Part Class: Extended Part
C9 = 10uF: Supplier: LCSC; Manufacturer Part: CL21A106KAYNNNE; Manufacturer: SAMSUNG(三星); Supplier Part: C15850; JLCPCB Part Class: Basic Part; nameAlias: Value; spicePre: C; spiceSymbolName: CL21A106KAYNNNE
D5 = PSM712-ES: Polarity:Bidirectional Reverse Stand-Off Voltage (Vrwm):12V；7V Clamping Voltage:19V；26V Peak Pulse Current (Ipp):17A Peak Pulse Power Dissipation (Ppp):- Voltage - Breakdown:7.5V；13.3V Reverse Leakage Current (Ir):1uA Number of Channels:Dual channel Opera; LCSC Part Name: 712，两路双向ESD静电防护器件，30kV，CJ：40pF；RS485/RS422串口通讯防护; Supplier Part: C5180294; Manufacturer: ElecSuper(静芯微); Supplier Footprint: SOT-23; JLCPCB Part Class: Extended Part; Datasheet: https://atta.szlcsc.com/upload/public/pdf/source/20240905/D084235AB9799A62A6C53EFD06F4CEE8.pdf; Supplier: LCSC; Polarity: Bidirectional; Reverse Stand-Off Voltage (Vrwm): 12V；7V; Clamping Voltage: 19V；26V; Peak Pulse Current (Ipp): 17A; Voltage - Breakdown: 7.5V；13.3V; Reverse Leakage Current (Ir): 1uA; Number of Channels: Dual channel; Type: ESD
J5 J9 J11 J13 J14 J16 J18-J22 = ZX-XH2.54-3PZZ: Pins Structure:1x3P Pitch:2.5mm Mounting Type:Direct Insert Reference Series:XH Number of Pins:3P Number of Rows:1 Number of PINs Per Row:3 Row Spacing:- Rated Current:3A Contact Material:Brass Contact Plating:Tin Operating Temperature:-25℃~+85℃ Operating; LCSC Part Name: 1x3P 间距:2.5mm 直插 系列:XH; Supplier Part: C7429633; Manufacturer: Megastar(兆星); Supplier Footprint: 插件,P=2.5mm; JLCPCB Part Class: Extended Part; Datasheet: https://atta.szlcsc.com/upload/public/pdf/source/20230619/AE17037A2CFDBE8D9CBA775D61AD0A84.pdf; Supplier: LCSC; Pins Structure: 1x3P; Pitch: 2.5mm; Mounting Type: Direct Insert; Reference Series: XH; Number of Pins: 3P; Number of Rows: 1; Number of PINs Per Row: 3; Rated Current: 3A; Contact Material: Brass; Contact Plating: Tin; Operating Temperature: -25℃~+85℃; Rated Voltage (Max): 250V; Plastic Material: PA66; Flame Retardant Rating: UL94V-0; Color: White; Z-Height of the Board: 7mm; X-Length of Bottom Edge on Board (Spacing Line): 10mm; Y-Width of Bottom Edge on Board: 5.9mm
J6-J8 J10 J12 J15 J17 J23 J24 = B5B-XH-A-M(LF)(SN): Pins Structure:1x5P Pitch:2.5mm Mounting Type:Direct Insert Reference Series:XH Number of Pins:5P Number of Rows:1 Number of PINs Per Row:5 Row Spacing:- Current Rating:3A Contact Material:Brass Contact Plating:Tin Operating Temperature:-25℃~+85℃ Operatin; LCSC Part Name: 绿色 1x5P 间距:2.5mm 直插 系列:XH; Supplier Part: C495550; Manufacturer: JST; Supplier Footprint: 插件,P=2.5mm; JLCPCB Part Class: Extended Part; Datasheet: https://atta.szlcsc.com/upload/public/pdf/source/20200407/C495550_C7A14141AE4358B9E26776A57828CC05.pdf; Supplier: LCSC; Pins Structure: 1x5P; Pitch: 2.5mm; Mounting Type: Direct Insert; Reference Series: XH; Number of Pins: 5P; Number of Rows: 1; Number of PINs Per Row: 5; Current Rating: 3A; Contact Material: Brass; Contact Plating: Tin; Operating Temperature: -25℃~+85℃; Voltage Rating: 250V; Plastic Material: PA66; Flame Retardant Rating: UL94V-0; Supplementary Features: K-leg punch; Color: Green; Z-Height of the Board: 7mm; X-Length of Bottom Edge on Board (Spacing Line): 14.9mm; Y-Width of Bottom Edge on Board: 5.75mm
OPT1 OPT2 = TLP521GB-S: Supplier: LCSC; Supplier Part: C364143; Manufacturer: UMW(广东友台半导体); JLCPCB Part Class: Extended Part; link: https://lcsc.com/eda_search?q=C364143&amp;%26type=1&amp;ref=editor
PS1 = B0505XT-1WR3S: Supplier: LCSC; Supplier Part: C713219; Manufacturer: rlt; JLCPCB Part Class: Extended Part; Contributor: LCSC; spicePre: U
Q4 = BSS138: Supplier: LCSC; Manufacturer: CJ(江苏长电/长晶); Supplier Part: C78284; JLCPCB Part Class: Extended Part; spicePre: Q
R10 = CR0402FF2200G: Type:Thick Film Resistors Resistance: Tolerance:±1% Tolerance:±1% Power(Watts): Overload Voltage (Max): Temperature Coefficient:±200ppm/℃ Temperature Coefficient:±200ppm/℃ Operating Temperature Range:-55℃~+125℃ Operating Temperature Range:-55℃~+125℃; LCSC Part Name: 厚膜电阻 220Ω ±1% 62.5mW; Supplier Part: C100308; Manufacturer: LIZ(丽智电子); Supplier Footprint: 0402; JLCPCB Part Class: Extended Part; Datasheet: https://atta.szlcsc.com/upload/public/pdf/source/20180403/C189438_6D658388CC7843F35BBC9018D03F0B8E.pdf; Supplier: LCSC; Type: Thick Film Resistors; Tolerance: ±1%; Temperature Coefficient: ±200ppm/℃; Operating Temperature Range: -55℃~+125℃
R15 R20 = RC0402FR-07402RL: Type:Thick Film Resistors Resistance: Tolerance:±1% Tolerance:±1% Power(Watts): Overload Voltage (Max): Temperature Coefficient:±100ppm/℃ Temperature Coefficient:±100ppm/℃ Operating Temperature Range:-55℃~+155℃ Operating Temperature Range:-55℃~+155℃; LCSC Part Name: 厚膜电阻 402Ω ±1% 62.5mW; Supplier Part: C137984; Manufacturer: YAGEO(国巨); Supplier Footprint: 0402; JLCPCB Part Class: Extended Part; Datasheet: https://atta.szlcsc.com/upload/public/pdf/source/20181009/C309620_DA5935B6E1D48212CB7A533FE518B3C2.pdf; Supplier: LCSC; Type: Thick Film Resistors; Tolerance: ±1%; Temperature Coefficient: ±100ppm/℃; Operating Temperature Range: -55℃~+155℃
R17 = SCR0402J100R: Type:Thick Film Resistors Resistance: Tolerance:±5% Tolerance:±5% Power(Watts): Overload Voltage (Max): Operating Temperature Range:-55℃~+155℃ Operating Temperature Range:-55℃~+155℃; LCSC Part Name: 厚膜电阻 100Ω ±5% 62.5mW; Supplier Part: C3017466; Manufacturer: VO(翔胜); Supplier Footprint: 0402; JLCPCB Part Class: Extended Part; Datasheet: https://atta.szlcsc.com/upload/public/pdf/source/20220513/247AF9639BA21CF93567DC289CCC6A22.pdf; Supplier: LCSC; Type: Thick Film Resistors; Tolerance: ±5%; Operating Temperature Range: -55℃~+155℃
R39 R40 = CR0402FF3000G: Type:Thick Film Resistors Resistance: Tolerance:±1% Tolerance:±1% Power(Watts): Overload Voltage (Max): Temperature Coefficient:±200ppm/℃ Temperature Coefficient:±200ppm/℃ Operating Temperature Range:-55℃~+125℃ Operating Temperature Range:-55℃~+125℃; LCSC Part Name: 厚膜电阻 300Ω ±1% 62.5mW; Supplier Part: C100360; Manufacturer: LIZ(丽智电子); Supplier Footprint: 0402; JLCPCB Part Class: Extended Part; Datasheet: https://atta.szlcsc.com/upload/public/pdf/source/20180403/C189438_6D658388CC7843F35BBC9018D03F0B8E.pdf; Supplier: LCSC; Type: Thick Film Resistors; Tolerance: ±1%; Temperature Coefficient: ±200ppm/℃; Operating Temperature Range: -55℃~+125℃
R47 = PTFR0402B4K99P9: Type:Thin Film Resistor Resistance:4.99kΩ Tolerance:±0.1% Tolerance:±0.1% Power(Watts):60mW Voltage-Supply(Max):75V Temperature Coefficient:±25ppm/℃ Temperature Coefficient:±25ppm/℃ Operating Temperature:-55℃~+125℃ Operating Temperature:-55℃~+125℃; LCSC Part Name: 薄膜电阻 4.99kΩ ±0.1% 60mW; Supplier Part: C2692734; Manufacturer: RESI(开步睿思); Supplier Footprint: 0402; JLCPCB Part Class: Extended Part; Datasheet: https://atta.szlcsc.com/upload/public/pdf/source/20240506/11BDC7478D84177AC2A5326A65B6EB29.pdf; Supplier: LCSC; Type: Thin Film Resistor; Tolerance: ±0.1%; Power(Watts): 60mW; Voltage-Supply(Max): 75V; Temperature Coefficient: ±25ppm/℃; Operating Temperature: -55℃~+125℃
U4 = ADUM3201ARZ-RL7: Supplier: LCSC; Manufacturer: ADI(亚德诺)/LINEAR(凌特); Supplier Part: C9824; JLCPCB Part Class: Extended Part; spicePre: U
U5 = SN65HVD3082EDR: Supplier: LCSC; Manufacturer: TI(德州仪器); Supplier Part: C6912; JLCPCB Part Class: Extended Part; spicePre: X
U8 = LM358ADT: Supplier: LCSC; Manufacturer: STMicroelectronics; Supplier Part: C92457; JLCPCB Part Class: Extended Part
VR1 = TC33X-2-203E: Resistance: Tolerance:±25% Tolerance:±25% Rated Voltage:- Power(Watts): Temperature Coefficient:±250ppm/℃ Temperature Coefficient:±250ppm/℃ Turns:; LCSC Part Name: 20kΩ ±25%; Supplier Part: C720648; Manufacturer: BOURNS; Supplier Footprint: SMD-3P,3.8x3.6mm; JLCPCB Part Class: Extended Part; Datasheet: https://atta.szlcsc.com/upload/public/pdf/source/20200810/C720646_BB66A75E654D5E1D30127FF45BCD3C26.pdf; Supplier: LCSC; Tolerance: ±25%; Temperature Coefficient: ±250ppm/℃
D12-D21 = RB521S-30_C727120: Diode Configuration:Independent Type Forward Voltage (Vf@If):500mV@200mA Reverse Voltage (Vr):30V Rectified Current:200mA Reverse Leakage Current (Ir):30uA@10V; LCSC Part Name: 电压:30V 电流:200mA; Supplier Part: C727120; Manufacturer: TWGMC(台湾迪嘉); Supplier Footprint: SOD-523; JLCPCB Part Class: Extended Part; Datasheet: https://atta.szlcsc.com/upload/public/pdf/source/20200828/C727120_3E9BC491271A3437FD0D1FDCF4FF716C.pdf; Supplier: LCSC; Diode Configuration: Independent Type; Forward Voltage (Vf@If): 500mV@200mA; Reverse Voltage (Vr): 30V; Rectified Current: 200mA; Reverse Leakage Current (Ir): 30uA@10V
H3 = PZ254V-11-03P: Pin Structure:1x3P Pitch:2.54mm Row Spacing:- Circluar Pins/Square Pins:Pin Header Mounting Type:Through Hole Number of Rows:1 Number of Pins:3P Current Rating:3A Voltage Rating (Max):250V Length of Mating Pin:6mm Insulation Height:2.5mm Length of End Con; LCSC Part Name: 1x3P 间距:2.54mm 方针 直插; Supplier Part: C2937625; Manufacturer: XFCN(兴飞); Supplier Footprint: 插件,P=2.54mm; JLCPCB Part Class: Extended Part; Datasheet: https://item.szlcsc.com/datasheet/PZ254V-11-03P/3293280.html; Supplier: LCSC; Pin Structure: 1x3P; Pitch: 2.54mm; Circluar Pins/Square Pins: Pin Header; Mounting Type: Through Hole; Number of Rows: 1; Number of Pins: 3P; Current Rating: 3A; Voltage Rating (Max): 250V; Length of Mating Pin: 6mm; Insulation Height: 2.5mm; Length of End Connection Pin: 3mm; Operating Temperature: -40℃~+105℃; Color: Black
OPT3-OPT12 = TLP521GB-S: Supplier: LCSC; Supplier Part: C364143; Manufacturer: UMW(广东友台半导体); JLCPCB Part Class: Extended Part; link: https://lcsc.com/eda_search?q=C364143&%26type=1&ref=editor; Contributor: LCSC; spicePre: U
PTC1 = SMD0805P050TF/12: Voltage - Max:12V Current - Max:30A Hold Current:500mA Trip Current:1A Power Dissipation:500mW Resistance - Initial (Ri) (Min):100mΩ Resistance - Post Trip (R1) (Max):850mΩ Time to Trip(Max):100ms Operating Temperature:-40℃~+85℃ Operating Temperature:-40℃; LCSC Part Name: 12V 500mA 0805自恢复; Supplier Part: C90129; Manufacturer: RUILON(瑞隆源); Supplier Footprint: 0805; JLCPCB Part Class: Extended Part; Datasheet: https://item.szlcsc.com/datasheet/SMD0805P050TF%252F12/91314.html; Supplier: LCSC; Voltage - Max: 12V; Current - Max: 30A; Hold Current: 500mA; Trip Current: 1A; Power Dissipation: 500mW; Resistance - Initial (Ri) (Min): 100mΩ; Resistance - Post Trip (R1) (Max): 850mΩ; Time to Trip(Max): 100ms; Operating Temperature: -40℃~+85℃; Length: 2.2mm; Width: 1.5mm; Height: 1mm
R85-R92 R97 R98 = RMC04026801%N: Resistance: Tolerance:±1% Tolerance:±1% Power(Watts):; LCSC Part Name: 680Ω ±1% 62.5mW; Supplier Part: C325567; Manufacturer: Tyohm(幸亚电阻); Supplier Footprint: 0402; JLCPCB Part Class: Extended Part; Datasheet: https://atta.szlcsc.com/upload/public/pdf/source/20190115/C325956_D27151D492FFB3C9AB4A6F14FE01F30A.pdf; Supplier: LCSC; Tolerance: ±1%
U9-U11 = 74AHCT595T16-13: Supplier: LCSC; Supplier Part: C460504; Manufacturer: DIODES(美台); JLCPCB Part Class: Extended Part; link: https://lcsc.com/eda_search?q=C460504&amp;%26type=1&amp;ref=editor

## Nets
+3V3: C11.2 C15.2 C16.1 C17.2 C18.1 LED2.2(A) LED11.2(A) LED15.2(A) LED19.2(A) LED20.2(A) LED24.2(A) LED28.2(A) LED32.2(A) LED33.2(A) LED34.2(A) LED35.2(A) LED46.2(A) R30.2 R32.2 R50.2 R57.2 R63.2 R69.2 R73.2 R79.2 R82.2 R93.2 R95.2 R107.2 SD1.4(VDD) U3.2(Output) U4.1(VDD1) U7.7(REGIN) U14.2(3V3)
+5V: C4.2 C5.1 C10.1 C12.2 C27.2 C28.2 C29.2 C31.1 C32.1 D25.2(A) H3.1 J6.1 J8.1 J10.1 J12.1 J15.1 J17.1 J23.1 J24.1 J67.3 L1.2 LED47.2(A) PS1.2(+VIN) R84.2 R121.2 RJ1.3 U2.14(VCC) U3.3(Input) U9.16(VCC) U10.16(VCC) U11.16(VCC)
+5V_ISO: C9.2 C13.1 C14.2 PS1.5(+VO) R10.2 R13.2 R15.2 U4.8(VDD2) U5.8(VCC)
+12V: C2.2 C3.2 C26.2 D2.1(K) D3.1(K) D4.1(K) H3.3 J67.2 Q1.3(S) RJ1.2 TB1.3 TB1.5 U1.2(VIN) U8.8(VCC+)
GND: C2.1 C3.1 C4.1 C5.2 C6.1 C7.1 C10.2 C11.1 C12.1 C15.1 C16.2 C17.1 C18.2 C19.1 C21.1 C22.2 C23.1 C24.2 C25.1 C26.1 C27.1 C28.1 C29.1 C30.1 C31.2 C32.2 D1.2(A) D6.1 D7.1 D9.1 D10.1 D11.1 D22.1 D23.1 D24.1 J1.2 J2.2 J3.2 J4.2 J6.2 J7.5 J8.2 J9.2 J10.2 J11.2 J12.2 J13.2 J14.2 J15.2 J16.2 J17.2 J18.2 J19.2 J20.2 J21.2 J22.2 J23.2 J24.2 J67.1 J67.12 LED8.1(K) LED9.1(K) LED10.1(K) LED12.1(K) LED13.1(K) LED14.1(K) LED16.1(K) LED17.1(K) LED18.1(K) LED21.1(K) LED22.1(K) LED23.1(K) LED25.1(K) LED26.1(K) LED27.1(K) LED29.1(K) LED30.1(K) LED31.1(K) LED36.1(K) LED37.1(K) LED38.1(K) LED39.1(K) LED40.1(K) LED41.1(K) MH1.1 MH2.1 MH3.1 MH4.1 OPT1.2 OPT2.2 OPT3.3 OPT4.3 OPT5.3 OPT6.3 OPT7.3 OPT8.3 OPT9.3 OPT10.3 OPT11.3 OPT12.3 PS1.1(-VIN) Q2.3(S) Q3.3(S) R1.1 R3.1 R12.1 R31.1 R33.1 R34.1 R35.1 R54.1 R71.1 R105.1 R106.1 R110.2 R111.2 R112.2 R113.2 R116.1 R117.1 R118.1 R119.1 R120.1 RJ1.1 RJ1.6 SD1.6(VSS) SD1.10(GND) SD1.11(GND) SD1.12(GND) SD1.13(GND) TB1.2 U1.7(GND) U1.9(EP) U2.1(1OE#) U2.4(2OE#) U2.7(GND) U2.10(3OE#) U2.13(4OE#) U3.1(GND/ADJ) U4.4(GND1) U7.3(GND) U7.29(EP) U8.4(VCC-) U8.5(IN2+) U9.8(GND) U9.13(OE#) U10.8(GND) U10.13(OE#) U11.8(GND) U11.13(OE#) U13.2(GND) U14.1(GND) U14.40(GND) U14.41(GND) USB1.1(GND) USB1.12(GND) USB1.13(SHELL) USB1.14(SHELL) USB2.1(GND) USB2.12(GND) USB2.13(SHELL) USB2.14(SHELL)
GND_ISO: C9.1 C13.2 C14.1 D5.3 J5.3 PS1.4(0V) Q4.2(S) R10.1 R20.1 U4.5(GND2) U5.5(GND)
VBUS: C23.2 C24.1 D11.2 U7.8(VBUS) USB1.2(VBUS) USB1.11(VBUS)
VIN: Q1.4(D) TB1.1
A_DIR: J12.3 R61.2 U10.2(Q2)
A_ENABLE: J12.5 R59.2 U10.3(Q3)
A_STEP: J12.4 R60.2 U10.1(Q1)
B_DIR: J15.3 R68.2 U10.5(Q5)
B_ENABLE: J15.5 R66.2 U10.6(Q6)
B_STEP: J15.4 R67.2 U10.4(Q4)
C_DIR: J17.3 R77.2 U11.15(Q0)
C_ENABLE: J17.5 R75.2 U11.1(Q1)
C_STEP: J17.4 R76.2 U10.7(Q7)
CS_SD: SD1.2(CDDAT3(CS)) U14.17(IO9)
DTR: Q6.2(E) R28.1 U7.28(DTR)
ESP32_EN: C19.2 Q5.3(C) R30.1 SW1.2 U14.3(EN)
EXP_RXD: R26.1 U14.28(IO35)
GPIO_0: Q6.3(C) R27.1 R32.1 SW2.2 U14.27(IO0)
GPIO_3: OPT12.4 R95.1 R96.1 U14.15(IO3)
GPIO_4: R5.1 R11.1 R119.2 U14.4(IO4)
GPIO_5: R8.1 R16.1 R118.2 U14.5(IO5)
GPIO_6: R48.1 U14.6(IO6)
GPIO_7: R39.1 U14.7(IO7)
GPIO_8: R40.1 U14.12(IO8)
GPIO_10: J67.6 U14.18(IO10)
GPIO_13: J67.5 U14.21(IO13)
GPIO_14: J67.4 U14.22(IO14)
GPIO_15: J67.7 U14.8(IO15)
GPIO_36: OPT9.4 R78.1 R79.1 U14.29(IO36)
GPIO_37: OPT8.4 R72.1 R73.1 U14.30(IO37)
GPIO_38: OPT7.4 R65.1 R69.1 U14.31(IO38)
GPIO_39: OPT6.4 R62.1 R63.1 U14.32(IO39)
GPIO_40: OPT5.4 R56.1 R57.1 U14.33(IO40)
GPIO_41: OPT4.4 R49.1 R50.1 U14.34(IO41)
GPIO_42: OPT3.4 R44.1 R107.1 U14.35(IO42)
GPIO_45: R6.2 R116.2 U14.26(IO45)
GPIO_46: R9.2 R117.2 U14.16(IO46)
GPIO_47: OPT11.4 R93.1 R94.1 U14.24(IO47)
GPIO_48: OPT10.4 R81.1 R82.1 U14.25(IO48)
I2S_BCK: R71.2 U9.11(SHCP) U10.11(SHCP) U11.11(SHCP) U14.9(IO16)
I2S_DATA: U9.14(DS) U14.10(IO17)
I2S_MR#: C30.2 R84.1 U9.10(MR#) U10.10(MR#) U11.10(MR#)
I2S_WS: U9.12(STCP) U10.12(STCP) U11.12(STCP) U14.11(IO18)
MISO: SD1.7(DAT0(D0)) U14.38(IO2)
MOSI: SD1.3(CMD(DI)) U14.39(IO1)
RS485_RX: R114.1 U4.2(VOA) U14.19(IO11)
RS485_TX: R115.1 U4.3(VIB) U14.20(IO12)
RTS: Q5.2(E) R29.1 U7.24(RTS)
SCK: SD1.5(CLK(SCLK)) U14.23(IO21)
SW_VCC: J9.1 J11.1 J13.1 J14.1 J16.1 J18.1 J19.1 J20.1 J21.1 J22.1 PTC1.2 R85.1 R86.1 R87.1 R88.1 R89.1 R90.1 R91.1 R92.1 R97.1 R98.1
U0RXD_GPIO_44: U7.26(TXD) U14.36(RXD0)
U0TDX_GPIO_43: U7.25(RXD) U14.37(TXD0)
U_DIR: J23.3 R101.2 U11.3(Q3)
U_ENABLE: J23.5 R99.2 U11.4(Q4)
U_STEP: J23.4 R100.2 U11.2(Q2)
USB_D+: D23.2 U14.14(IO20) USB2.6(DP1) USB2.8(DP2)
USB_D-: D24.2 U14.13(IO19) USB2.5(DN2) USB2.7(DN1)
V_DIR: J24.3 R104.2 U11.6(Q6)
V_ENABLE: J24.5 R102.2 U11.7(Q7)
V_STEP: J24.4 R103.2 U11.5(Q5)
X_DIR: J6.3 R38.2 U9.1(Q1)
X_ENABLE: J6.5 R36.2 U9.2(Q2)
X_STEP: J6.4 R37.2 U9.15(Q0)
Y_DIR: J8.3 R43.2 U9.4(Q4)
Y_ENABLE: J8.5 R41.2 U9.5(Q5)
Y_STEP: J8.4 R42.2 U9.3(Q3)
Z_DIR: J10.3 R53.2 U9.7(Q7)
Z_ENABLE: J10.5 R51.2 U10.15(Q0)
Z_STEP: J10.4 R52.2 U9.6(Q6)
$1N12844: R3.2 U1.4(RT/CLK)
$1N12846: C7.2 R4.1
$1N12847: C6.2 R4.2 U1.6(COMP)
$1N12850: R120.2 R121.1 U1.5(FB)
$1N12851: C1.1 D1.1(K) L1.1 U1.8(SW)
$1N12852: C1.2 U1.1(BOOT)
$1N12896: R31.2 SW1.1
$1N12898: R33.2 SW2.1
$1N12906: D9.2 U7.5(D-) USB1.5(DN2) USB1.7(DN1)
$1N12910: C21.2 C22.1 U7.6(VDD)
$1N12914: D10.2 U7.4(D+) USB1.6(DP1) USB1.8(DP2)
$1N12917: R35.2 USB1.4(CC1)
$1N12918: R34.2 USB1.10(CC2)
$1N13674: D3.2(A) Q2.2(D) Q2.4(D) TB1.6
$1N13675: D4.2(A) Q3.2(D) Q3.4(D) TB1.4
$1N13682: J1.1 LED45.2(A) U2.3(1Y)
$1N13683: J2.1 LED42.2(A) U2.6(2Y)
$1N13684: R8.2 U2.5(2A)
$1N13685: R5.2 U2.2(1A)
$1N13688: R6.1 U2.12(4A)
$1N13689: R9.1 U2.9(3A)
$1N13694: Q3.1(G) R16.2
$1N13695: Q2.1(G) R11.2
$1N15211: D6.2 R26.2 RJ1.5
$1N15212: D7.2 R27.2 RJ1.4
$1N21977: J3.1 LED44.2(A) U2.11(4Y)
$1N24535: D2.2(A) Q1.1(G) R12.2
$1N30735: J4.1 LED43.2(A) U2.8(3Y)
$1N36177: Q5.1(B) R28.2
$1N36205: Q6.1(B) R29.2
$1N87974: R106.2 USB2.4(CC1)
$1N87975: R105.2 USB2.10(CC2)
$1N95227: D22.2 U13.5(VOUT) USB2.2(VBUS) USB2.11(VBUS)
$1N104321: LED42.1(K) R110.1
$1N104498: LED44.1(K) R112.1
$1N104596: LED45.1(K) R113.1
$1N104722: LED43.1(K) R111.1
$1N111576: D25.1(K) U13.1(VIN) U13.3(ENABLE)
$1N120737: LED47.1(K) R1.2
$2N5204: U8.6(IN2-) U8.7(OUT2)
$2N5207: J7.4 U8.1(OUT1) VR1.2
$2N5208: C25.2 R48.2 U8.3(IN1+)
$2N5209: R47.1 R54.2 U8.2(IN1-)
$2N5212: OPT1.1 R39.2
$2N5213: OPT2.1 R40.2
$2N5216: J7.3 OPT1.3 OPT2.3
$2N5219: J7.2 OPT1.4
$2N5220: J7.1 OPT2.4
$2N63965: D5.1 J5.1 R15.1 R18.1 U5.6(A)
$2N63966: D5.2 J5.2 R18.2 R20.2 U5.7(B)
$2N63969: Q4.3(D) R13.1 U5.2(nRE) U5.3(DE)
$2N63970: R17.2 U5.1(R)
$2N63971: R17.1 U4.7(VIA)
$2N63972: R19.2 U4.6(VOB) U5.4(D)
$2N63974: Q4.1(G) R19.1
$2N63981: LED2.1(K) R114.2
$2N79661: R47.2 VR1.1
$2N80653: LED46.1(K) R115.2
$3N6308: LED12.2(A) R41.1
$3N6311: LED13.2(A) R42.1
$3N6313: LED14.2(A) R43.1
$3N6319: LED16.2(A) R51.1
$3N6322: LED17.2(A) R52.1
$3N6324: LED18.2(A) R53.1
$3N6330: LED21.2(A) R59.1
$3N6333: LED22.2(A) R60.1
$3N6335: LED23.2(A) R61.1
$3N6341: LED25.2(A) R66.1
$3N6344: LED26.2(A) R67.1
$3N6346: LED27.2(A) R68.1
$3N6352: LED29.2(A) R75.1
$3N6355: LED30.2(A) R76.1
$3N6357: LED31.2(A) R77.1
$3N6360: LED11.1(K) R44.2
$3N6361: OPT3.1 R85.2
$3N6368: LED15.1(K) R49.2
$3N6369: D13.1(K) J11.3
$3N6375: LED19.1(K) R56.2
$3N6376: D14.1(K) J13.3
$3N6382: LED20.1(K) R62.2
$3N6383: D15.1(K) J14.3
$3N6389: LED24.1(K) R65.2
$3N6390: D16.1(K) J16.3
$3N6396: LED28.1(K) R72.2
$3N6397: D17.1(K) J18.3
$3N6403: LED32.1(K) R78.2
$3N6404: D18.1(K) J19.3
$3N6410: LED33.1(K) R81.2
$3N6411: D19.1(K) J20.3
$3N6414: LED8.2(A) R36.1
$3N6415: LED9.2(A) R37.1
$3N6416: LED10.2(A) R38.1
$3N6418: D12.1(K) J9.3
$3N6419: D12.2(A) OPT3.2
$3N6420: D13.2(A) OPT4.2
$3N6421: OPT4.1 R86.2
$3N6422: D14.2(A) OPT5.2
$3N6423: OPT5.1 R87.2
$3N6424: D15.2(A) OPT6.2
$3N6425: OPT6.1 R88.2
$3N6426: D16.2(A) OPT7.2
$3N6427: OPT7.1 R89.2
$3N6428: D17.2(A) OPT8.2
$3N6429: OPT8.1 R90.2
$3N6430: D18.2(A) OPT9.2
$3N6431: OPT9.1 R91.2
$3N6432: D19.2(A) OPT10.2
$3N6433: OPT10.1 R92.2
$3N6437: LED34.1(K) R94.2
$3N6438: D20.1(K) J21.3
$3N6444: LED35.1(K) R96.2
$3N6445: D21.1(K) J22.3
$3N6448: D20.2(A) OPT11.2
$3N6449: OPT11.1 R97.2
$3N6450: D21.2(A) OPT12.2
$3N6451: OPT12.1 R98.2
$3N6459: LED36.2(A) R99.1
$3N6462: LED37.2(A) R100.1
$3N6464: LED38.2(A) R101.1
$3N6470: LED39.2(A) R102.1
$3N6473: LED40.2(A) R103.1
$3N6475: LED41.2(A) R104.1
$3N19335: U9.9(Q7S) U10.14(DS)
$3N19343: U10.9(Q7S) U11.14(DS)
$3N36366: H3.2 PTC1.1

Not connected (* = marked no-connect by the designer): J67 8* 9* 10* 11*; MH5 1*; PS1 8(NC)*; SD1 1(DAT2(RSV))* 8(DAT1(RSV))* 9(CD)*; U1 3(EN)*; U3 4(Output)*; U7 1(DCD)* 2(RI)* 9(RST#)* 10(NC)* 11(SUSPEND#)* 12(SUSPEND)* 13(NC)* 14(NC)* 15(NC)* 16(NC)* 17(NC)* 18(NC)* 19(NC)* 20(NC)* 21(NC)* 22(NC)* 23(CTS)* 27(DSR)*; U11 9(Q7S)*; U13 4(FAULT#)*; USB1 3(SBU2)* 9(SBU1)*; USB2 3(SBU2)* 9(SBU1)*; VR1 3*

## Notes on the sheets
sheet 1
- GPIO45
- Gnd
- GPIO46
- Gnd
- GPIO.4
- Gnd
- GPIO.5
- Gnd
- Reverse voltage
  protection
- MOSFET (Gnd)
- 12V
- MOSFET (Gnd)
- Flyback diodes for
- 12V
- Gnd
- inductive loads
- 12V (Input)
- FNC_RX
- Gnd_ISO
- FNC_Tx
- 5v
- +12V
- Gnd_ISO
- output
- output
- 0-10 pwm
- input
- 10v_fwd
- i/o module
- input
- input
- input
- Reset
- input
- 10V rev
- input
- input
- expander
- expander
- Boot
- output
- input
- input
- input
- MOSFET
- i/o module
- i/o module
- i/o module
sheet 2
- (Spindle Fwd)
- Gnd
- 0-10V Output
- Common
- (Spindle Rev)
- Out1
- Out2
- (Spindle PWM)
- A
- B
- Gnd
sheet 3
- Switch VCC
- Gnd
- Signal
- Switch VCC
- Gnd
- Signal
- Switch VCC
- Signal
- Gnd
- Switch VCC
- Gnd
- Signal
- Switch VCC
- Gnd
- Signal
- Switch VCC
- Gnd
- Signal
- Switch VCC
- Signal
- Gnd
- Switch VCC
- Gnd
- Signal
- Switch VCC
- Gnd
- Signal
- Switch VCC
- Gnd
- Signal
